# Altium schematic sheet MainBoard.SCHDOC
size B
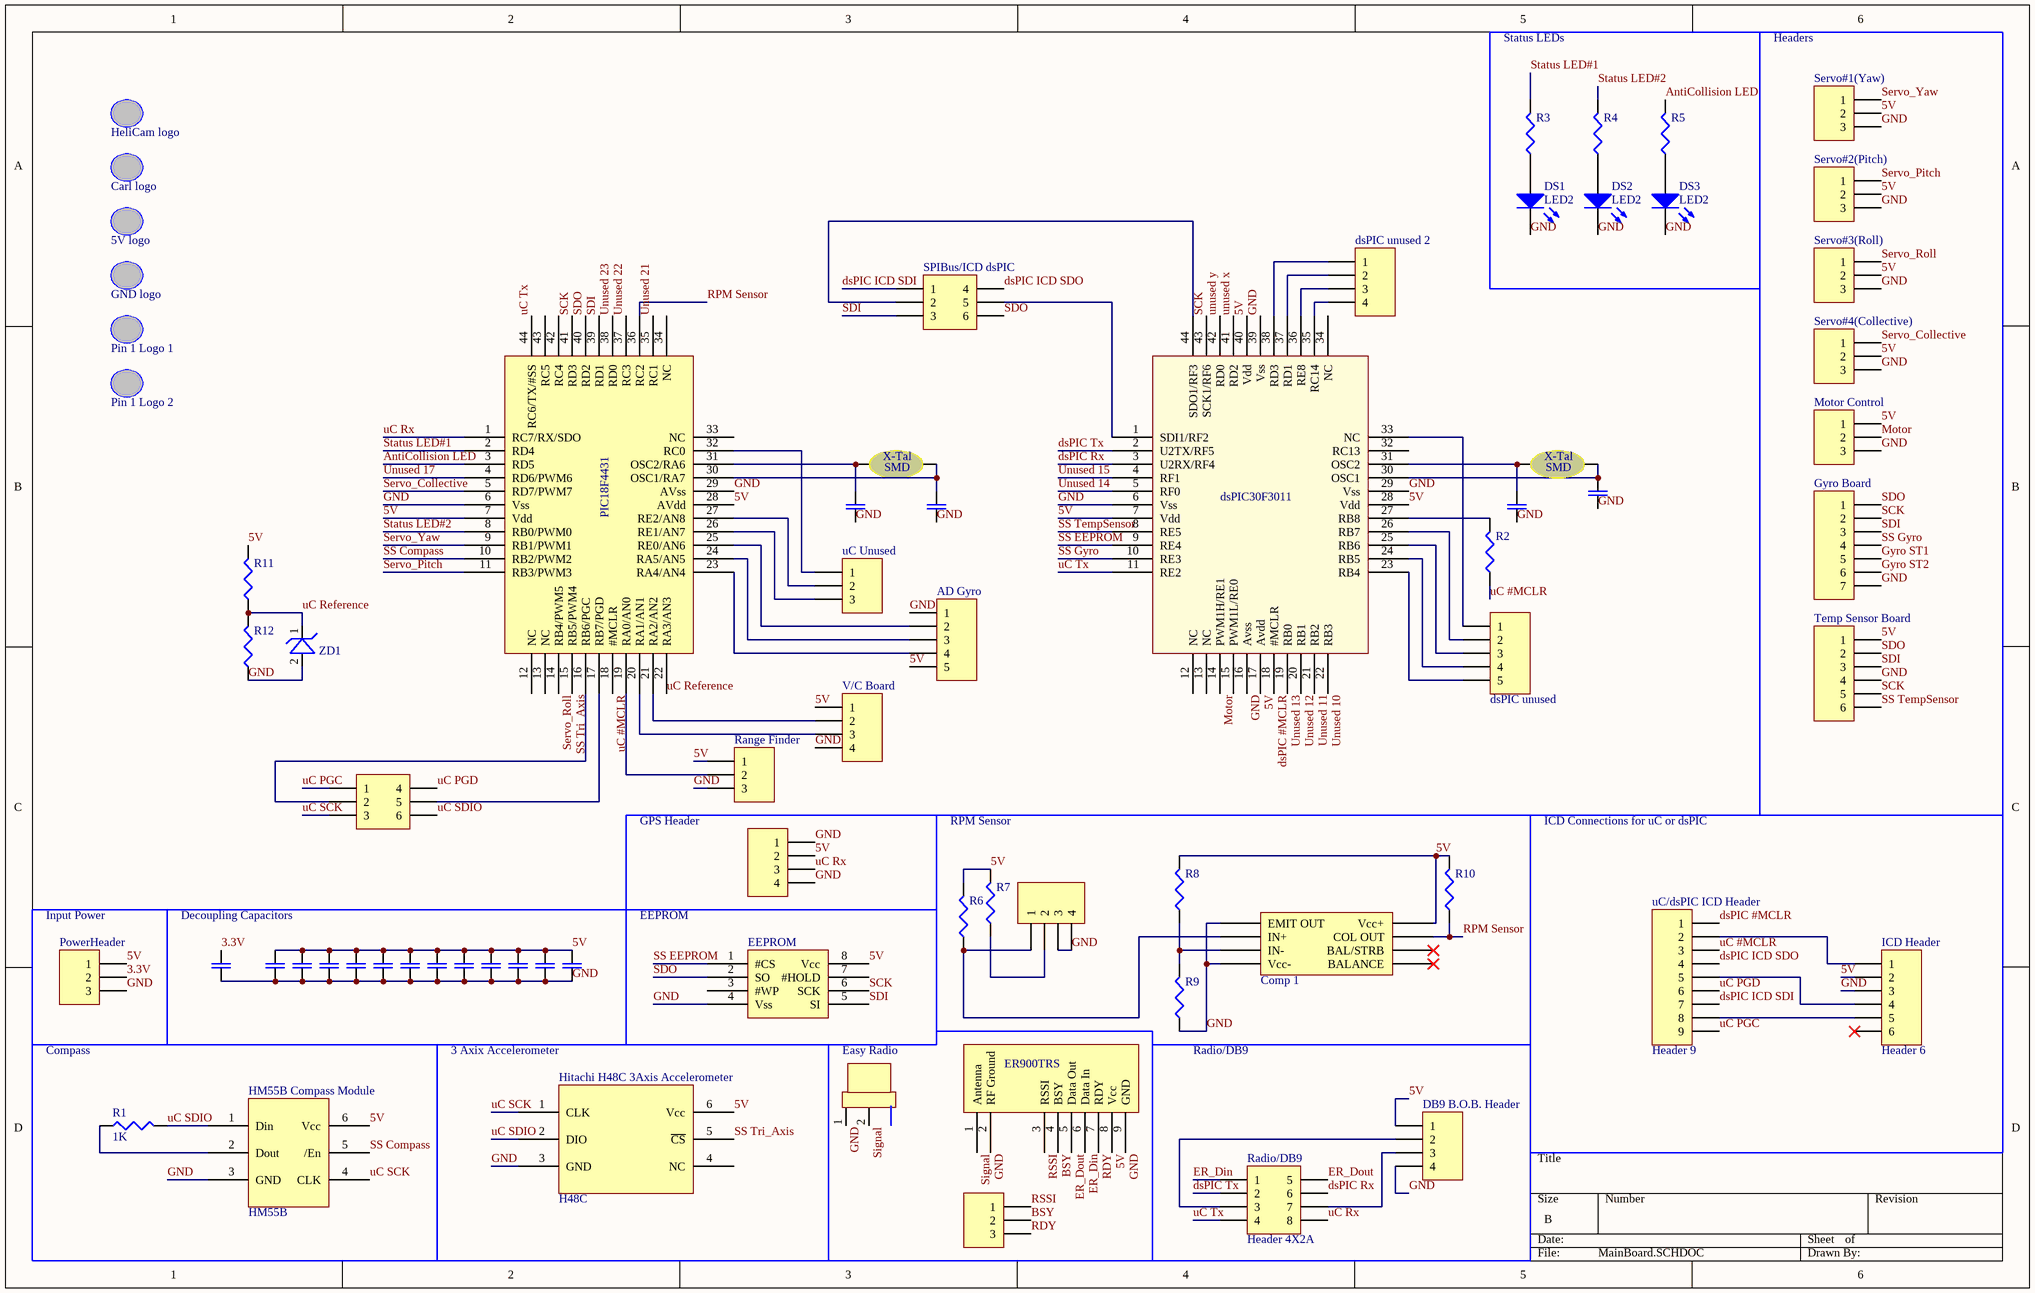
[diagram p0: MainBoard.SCHDOC]

## Parts
5V_logo  logo  [5V logo]  (value not drawn)
AD_Gyro  Header 5  [HDR1X5]  (value not drawn)
Antenna_Connector_1  Antenna Connector  [Antenna Connector]  (value not drawn)
Carl_logo  logo  [Carl Logo]  (value not drawn)
Comp_1  Comparator  [8-Pin DIP]  (value not drawn)
DB9_B.O.B._Header  DB9 Break Out Board Header  [HDR1X4]  (value not drawn)
DS1  LED2  [DSO-F2/D6.1]
DS2  LED2  [DSO-F2/D6.1]
DS3  LED2  [DSO-F2/D6.1]
dsPIC30F3011  dsPIC30F3011  [QFP7x7-G32/N]  (value not drawn)
dsPIC_unused  Header 5  [HDR1X5]  (value not drawn)
dsPIC_unused_2  Header 4  [HDR1X4]  (value not drawn)
EEPROM  25LC256 EEPROM  [EEPROM]  (value not drawn)
ER900TRS  Easy Radio 900MHz  [ER900TRS]  (value not drawn)
GND_logo  logo  [GND logo]  (value not drawn)
GPS_Header  GPS Header  [HDR1X4]  (value not drawn)
Gyro_Board  Header for Gyro Board  [HDR1X7]  (value not drawn)
H48C  Hitachi H48C 3Axis Accelerometer  [H48C]
HeliCam_logo  logo  [HeliCamosun]  (value not drawn)
HM55B  HM55B Compass Module  [HM55B]
ICD_Header  Header 6  [HDR1X6]
Motor_Control  Connector for Motor Control  [HDR1X3]  (value not drawn)
PIC18F4431  PIC18F4431  [QFP7x7-G32/N]  (value not drawn)
Pin_1_Logo_1  logo  [Pin 1 Logo]  (value not drawn)
Pin_1_Logo_2  logo  [Pin 1 Logo]  (value not drawn)
PowerHeader  Header 3  [HDR1X3]  (value not drawn)
R1  1K  [CR1608-0603]
R2  Res3  [CR1608-0603]  (value not drawn)
R3  Res3  [CR1608-0603]  (value not drawn)
R4  Res3  [CR1608-0603]  (value not drawn)
R5  Res3  [CR1608-0603]  (value not drawn)
R6  Res3  [CR1608-0603]  (value not drawn)
R7  Res3  [CR1608-0603]  (value not drawn)
R8  Res3  [CR1608-0603]  (value not drawn)
R9  Res3  [CR1608-0603]  (value not drawn)
R10  Res3  [CR1608-0603]  (value not drawn)
R11  Res3  [CR1608-0603]  (value not drawn)
R12  Res3  [CR1608-0603]  (value not drawn)
Radio/DB9  Header 4X2A  [HDR2X4_CEN]
Radio_Header  Extra Radio Pins  [HDR1X3]  (value not drawn)
Range_Finder  Header 3  [HDR1X3]  (value not drawn)
Servo#1(Yaw)  Connector for Servo Motor  [HDR1X3]  (value not drawn)
Servo#2(Pitch)  Connector for Servo Motor  [HDR1X3]  (value not drawn)
Servo#3(Roll)  Connector for Servo Motor  [HDR1X3]  (value not drawn)
Servo#4(Collective)  Connector for Servo Motor  [HDR1X3]  (value not drawn)
SMD_1206_1  SMD 1206  [SMD 1206]  (value not drawn)
SMD_1206_2  SMD 1206  [SMD 1206]  (value not drawn)
SMD_1206_3  SMD 1206  [SMD 1206]  (value not drawn)
SMD_1206_4  SMD 1206  [SMD 1206]  (value not drawn)
SMD_1206_5  SMD 1206  [SMD 1206]  (value not drawn)
SMD_1206_6  SMD 1206  [SMD 1206]  (value not drawn)
SMD_1206_7  SMD 1206  [SMD 1206]  (value not drawn)
SMD_1206_8  SMD 1206  [SMD 1206]  (value not drawn)
SMD_1206_9  SMD 1206  [SMD 1206]  (value not drawn)
SMD_1206_10  SMD 1206  [SMD 1206]  (value not drawn)
SMD_1206_11  SMD 1206  [SMD 1206]  (value not drawn)
SMD_1206_12  SMD 1206  [SMD 1206]  (value not drawn)
SMD_1206_13  SMD 1206  [SMD 1206]  (value not drawn)
SMD_1206_14  SMD 1206  [SMD 1206]  (value not drawn)
SMD_1206_15  SMD 1206  [SMD 1206]  (value not drawn)
SMD_1206_16  SMD 1206  [SMD 1206]  (value not drawn)
SMD_1206_17  SMD 1206  [SMD 1206]  (value not drawn)
SMD_X-Tal_1  SMD X-Tal  [SMD X-Tal]  (value not drawn)
SMD_X-Tal_2  SMD X-Tal  [SMD X-Tal]  (value not drawn)
SPIBus/ICD  Header 3X2A  [HDR2X3_CEN]  (value not drawn)
SPIBus/ICD_dsPIC  Header 3X2A  [HDR2X3_CEN]  (value not drawn)
Stef's_Connector  Header 4  [HDR1X4]  (value not drawn)
Temp_Sensor_Board  SPI Temp Sensor Header  [HDR1X6]  (value not drawn)
uC/dsPIC_ICD_Header  Header 9  [HDR1X9]
uC_Unused  Header 3  [HDR1X3]  (value not drawn)
V/C_Board  Voltage/Current Board Header  [HDR1X4]  (value not drawn)
ZD1  CZRF52C3  [Zener Diode]  (value not drawn)

## Nets
3.3V: PowerHeader.2 SMD_1206_10.1
5V: AD_Gyro.5 Comp_1.8(Vcc+) DB9_B.O.B._Header.1 dsPIC30F3011.7(Vdd) dsPIC30F3011.17(Avdd) dsPIC30F3011.28(Vdd) dsPIC30F3011.40(Vdd) EEPROM.8(Vcc) ER900TRS.8(Vcc) GPS_Header.2 H48C.6(Vcc) HM55B.6(Vcc) ICD_Header.2 Motor_Control.1 PIC18F4431.7(Vdd) PIC18F4431.28(AVdd) PowerHeader.1 R6.2 R7.2 R8.2 R10.2 R11.2 Range_Finder.1 Servo#1(Yaw).2 Servo#2(Pitch).2 Servo#3(Roll).2 Servo#4(Collective).2 SMD_1206_1.1 SMD_1206_2.1 SMD_1206_3.1 SMD_1206_4.1 SMD_1206_5.1 SMD_1206_6.1 SMD_1206_7.1 SMD_1206_8.1 SMD_1206_9.1 SMD_1206_15.1 SMD_1206_16.1 SMD_1206_17.1 Temp_Sensor_Board.1 V/C_Board.1
AntiCollision LED: PIC18F4431.3(RD5) R5.2
BSY: ER900TRS.4(BSY) Radio_Header.2
dsPIC #MCLR: dsPIC30F3011.18(#MCLR) uC/dsPIC_ICD_Header.1
dsPIC ICD SDI: SPIBus/ICD_dsPIC.1 uC/dsPIC_ICD_Header.7
dsPIC ICD SDO: SPIBus/ICD_dsPIC.4 uC/dsPIC_ICD_Header.4
dsPIC Rx: dsPIC30F3011.3(U2RX/RF4) Radio/DB9.6
dsPIC Tx: dsPIC30F3011.2(U2TX/RF5) Radio/DB9.2
ER_Din: ER900TRS.6(Data_In) Radio/DB9.1
ER_Dout: ER900TRS.5(Data_Out) Radio/DB9.5
GND: AD_Gyro.1 Antenna_Connector_1.1 Comp_1.1(EMIT_OUT) Comp_1.4(Vcc-) DB9_B.O.B._Header.4 DS1.2(K) DS2.2(K) DS3.2(K) dsPIC30F3011.6(Vss) dsPIC30F3011.16(Avss) dsPIC30F3011.29(Vss) dsPIC30F3011.39(Vss) EEPROM.4(Vss) ER900TRS.2(RF_Ground) ER900TRS.9(GND) GPS_Header.1 GPS_Header.4 Gyro_Board.7 H48C.3(GND) HM55B.3(GND) ICD_Header.3 Motor_Control.3 PIC18F4431.6(Vss) PIC18F4431.29(AVss) PowerHeader.3 R9.1 R12.1 Range_Finder.3 Servo#1(Yaw).3 Servo#2(Pitch).3 Servo#3(Roll).3 Servo#4(Collective).3 SMD_1206_1.2 SMD_1206_2.2 SMD_1206_3.2 SMD_1206_4.2 SMD_1206_5.2 SMD_1206_6.2 SMD_1206_7.2 SMD_1206_8.2 SMD_1206_9.2 SMD_1206_10.2 SMD_1206_11.2 SMD_1206_12.2 SMD_1206_13.2 SMD_1206_14.2 SMD_1206_15.2 SMD_1206_16.2 SMD_1206_17.2 Stef's_Connector.3 Stef's_Connector.4 Temp_Sensor_Board.4 V/C_Board.4 ZD1.2
Gyro ST1: Gyro_Board.5
Gyro ST2: Gyro_Board.6
Motor: dsPIC30F3011.14(PWM1H/RE1) Motor_Control.2
RDY: ER900TRS.7(RDY) Radio_Header.3
RPM Sensor: Comp_1.7(COL_OUT) PIC18F4431.36(RC2) R10.1
RSSI: ER900TRS.3(RSSI) Radio_Header.1
SCK: dsPIC30F3011.43(SCK1/RF6) EEPROM.6(SCK) Gyro_Board.2 PIC18F4431.41(RD3) Temp_Sensor_Board.5
SDI: EEPROM.5(SI) Gyro_Board.3 PIC18F4431.39(RD1) SPIBus/ICD_dsPIC.3 Temp_Sensor_Board.3
SDO: EEPROM.2(SO) Gyro_Board.1 PIC18F4431.40(RD2) SPIBus/ICD_dsPIC.6 Temp_Sensor_Board.2
Servo_Collective: PIC18F4431.5(RD7/PWM7) Servo#4(Collective).1
Servo_Pitch: PIC18F4431.11(RB3/PWM3) Servo#2(Pitch).1
Servo_Roll: PIC18F4431.14(RB4/PWM5) Servo#3(Roll).1
Servo_Yaw: PIC18F4431.9(RB1/PWM1) Servo#1(Yaw).1
Signal: Antenna_Connector_1.2 ER900TRS.1(Antenna)
SS Compass: HM55B.5(/En) PIC18F4431.10(RB2/PWM2)
SS EEPROM: dsPIC30F3011.9(RE4) EEPROM.1(#CS)
SS Gyro: dsPIC30F3011.10(RE3) Gyro_Board.4
SS TempSensor: dsPIC30F3011.8(RE5) Temp_Sensor_Board.6
SS Tri_Axis: H48C.5(~{CS}) PIC18F4431.15(RB5/PWM4)
Status LED#1: PIC18F4431.2(RD4) R3.2
Status LED#2: PIC18F4431.8(RB0/PWM0) R4.2
uC #MCLR: PIC18F4431.18(#MCLR) R2.1 uC/dsPIC_ICD_Header.3
uC PGC: SPIBus/ICD.1 uC/dsPIC_ICD_Header.9
uC PGD: SPIBus/ICD.4 uC/dsPIC_ICD_Header.6
uC Reference: PIC18F4431.22(RA3/AN3) R11.1 R12.2 ZD1.1
uC Rx: GPS_Header.3 PIC18F4431.1(RC7/RX/SDO) Radio/DB9.8
uC SCK: H48C.1(CLK) HM55B.4(CLK) SPIBus/ICD.3
uC SDIO: H48C.2(DIO) HM55B.1(Din) R1.2 SPIBus/ICD.6
uC Tx: dsPIC30F3011.11(RE2) PIC18F4431.44(RC6/TX/#SS) Radio/DB9.4
Unused 10: dsPIC30F3011.22(RB3)
Unused 11: dsPIC30F3011.21(RB2)
Unused 12: dsPIC30F3011.20(RB1)
Unused 13: dsPIC30F3011.19(RB0)
Unused 14: dsPIC30F3011.5(RF0)
Unused 15: dsPIC30F3011.4(RF1)
Unused 17: PIC18F4431.4(RD6/PWM6)
Unused 21: PIC18F4431.35(RC1)
Unused 22: PIC18F4431.37(RC3)
Unused 23: PIC18F4431.38(RD0)
unused x: dsPIC30F3011.41(RD2)
unused y: dsPIC30F3011.42(RD0)
NetAD_Gyro_2: AD_Gyro.2 PIC18F4431.25(RE0/AN6)
NetAD_Gyro_3: AD_Gyro.3 PIC18F4431.24(RA5/AN5)
NetAD_Gyro_4: AD_Gyro.4 PIC18F4431.23(RA4/AN4)
NetComp_1_2: Comp_1.2(IN+) R6.1 Stef's_Connector.1
NetComp_1_3: Comp_1.3(IN-) R8.1 R9.2
NetDB9_B.O.B._Header_2: DB9_B.O.B._Header.2 Radio/DB9.3
NetDB9_B.O.B._Header_3: DB9_B.O.B._Header.3 Radio/DB9.7
NetDS1_1: DS1.1(A) R3.1
NetDS2_1: DS2.1(A) R4.1
NetDS3_1: DS3.1(A) R5.1
NetdsPIC30F3011_1: dsPIC30F3011.1(SDI1/RF2) SPIBus/ICD_dsPIC.5
NetdsPIC30F3011_23: dsPIC30F3011.23(RB4) dsPIC_unused.5
NetdsPIC30F3011_24: dsPIC30F3011.24(RB5) dsPIC_unused.4
NetdsPIC30F3011_25: dsPIC30F3011.25(RB6) dsPIC_unused.3
NetdsPIC30F3011_26: dsPIC30F3011.26(RB7) dsPIC_unused.2
NetdsPIC30F3011_27: dsPIC30F3011.27(RB8) R2.2
NetdsPIC30F3011_30: dsPIC30F3011.30(OSC1) SMD_1206_14.1 SMD_X-Tal_2.2
NetdsPIC30F3011_31: dsPIC30F3011.31(OSC2) SMD_1206_13.1 SMD_X-Tal_2.1
NetdsPIC30F3011_33: dsPIC30F3011.33(NC) dsPIC_unused.1
NetdsPIC30F3011_35: dsPIC30F3011.35(RC14) dsPIC_unused_2.4
NetdsPIC30F3011_36: dsPIC30F3011.36(RE8) dsPIC_unused_2.3
NetdsPIC30F3011_37: dsPIC30F3011.37(RD1) dsPIC_unused_2.2
NetdsPIC30F3011_38: dsPIC30F3011.38(RD3) dsPIC_unused_2.1
NetdsPIC30F3011_44: dsPIC30F3011.44(SDO1/RF3) SPIBus/ICD_dsPIC.2
NetHM55B_2: HM55B.2(Dout) R1.1
NetICD_Header_1: ICD_Header.1 uC/dsPIC_ICD_Header.2
NetICD_Header_4: ICD_Header.4 uC/dsPIC_ICD_Header.5
NetICD_Header_5: ICD_Header.5 uC/dsPIC_ICD_Header.8
NetPIC18F4431_16: PIC18F4431.16(RB6/PGC) SPIBus/ICD.2
NetPIC18F4431_17: PIC18F4431.17(RB7/PGD) SPIBus/ICD.5
NetPIC18F4431_19: PIC18F4431.19(RA0/AN0) Range_Finder.2
NetPIC18F4431_20: PIC18F4431.20(RA1/AN1) V/C_Board.3
NetPIC18F4431_21: PIC18F4431.21(RA2/AN2) V/C_Board.2
NetPIC18F4431_26: PIC18F4431.26(RE1/AN7) uC_Unused.3
NetPIC18F4431_27: PIC18F4431.27(RE2/AN8) uC_Unused.2
NetPIC18F4431_30: PIC18F4431.30(OSC1/RA7) SMD_1206_12.1 SMD_X-Tal_1.2
NetPIC18F4431_31: PIC18F4431.31(OSC2/RA6) SMD_1206_11.1 SMD_X-Tal_1.1
NetPIC18F4431_32: PIC18F4431.32(RC0) uC_Unused.1
NetR7_1: R7.1 Stef's_Connector.2

Not connected (* = marked no-connect by the designer): Comp_1 5(BALANCE)* 6(BAL/STRB)*; dsPIC30F3011 12(NC) 13(NC) 15(PWM1L/RE0) 32(RC13) 34(NC); EEPROM 3(#WP) 7(#HOLD); H48C 4(NC); ICD_Header 6*; PIC18F4431 12(NC) 13(NC) 33(NC) 34(NC) 42(RC4) 43(RC5)

## Notes on the sheet
- Status LEDs
- Headers
- (near Range_Finder) GPS Header
- RPM Sensor
- ICD Connections for uC or dsPIC
- (near PowerHeader) Input Power
- Decoupling Capacitors
- EEPROM
- Compass
- 3 Axix Accelerometer
- Easy Radio
- (near R9) Radio/DB9
- (in symbol SMD X-Tal) X-Tal; SMD

## Library data of the parts
AD_Gyro dsPIC_unused = Header 5: Header, 5-Pin; LatestRevisionDate: 17-Jul-2002; LatestRevisionNote: Re-released for DXP Platform.; Publisher: Altium Limited
Comp_1 = LP311P
DB9_B.O.B._Header dsPIC_unused_2 GPS_Header Stef's_Connector V/C_Board = Header 4: Header, 4-Pin; Publisher: Altium Limited
  DB9_B.O.B._Header V/C_Board: Revision: 17-Jul-2002: Re-released for DXP Platform.
  dsPIC_unused_2 GPS_Header Stef's_Connector: LatestRevisionDate: 17-Jul-2002; LatestRevisionNote: Re-released for DXP Platform.
DS1-DS3 = LED2: Typical RED, GREEN, YELLOW, AMBER GaAs LED; Published: 8-Jun-2000; LatestRevisionDate: 17-Jul-2002; LatestRevisionNote: Re-released for DXP Platform.; PackageDocument: Feb-2002; PackageReference: 3.2X1.6X1.1; Publisher: Altium Limited
EEPROM = EEPROM
ER900TRS = ER900TRS
Gyro_Board = Header 7: Header, 7-Pin; Revision: 17-Jul-2002: Re-released for DXP Platform.; Publisher: Altium Limited
H48C = H48C: 3 Axis Accelerometer
ICD_Header Temp_Sensor_Board = Header 6: Header, 6-Pin; Publisher: Altium Limited
  ICD_Header: LatestRevisionDate: 17-Jul-2002; LatestRevisionNote: Re-released for DXP Platform.
  Temp_Sensor_Board: Revision: 17-Jul-2002: Re-released for DXP Platform.
Motor_Control PowerHeader Radio_Header Range_Finder Servo#1(Yaw) Servo#2(Pitch) Servo#3(Roll) Servo#4(Collective) uC_Unused = Header 3: Header, 3-Pin; Publisher: Altium Limited
  Motor_Control PowerHeader Servo#1(Yaw) Servo#2(Pitch) Servo#3(Roll) Servo#4(Collective): Revision: 17-Jul-2002: Re-released for DXP Platform.
  Radio_Header Range_Finder uC_Unused: LatestRevisionDate: 17-Jul-2002; LatestRevisionNote: Re-released for DXP Platform.
R1-R12 = Res3: Resistor; Published: 8-Jun-2000; LatestRevisionDate: 4-Mar-2005; LatestRevisionNote: PCB Footprint replaced.; Publisher: Altium Limited
Radio/DB9 = Header 4X2A: Header, 4-Pin, Dual row; LatestRevisionDate: 17-Jul-2002; LatestRevisionNote: Re-released for DXP Platform.; Publisher: Altium Limited
SMD_1206_1-SMD_1206_17 = SMD 1206: SMD 1206 Package Type
SPIBus/ICD SPIBus/ICD_dsPIC = Header 3X2A: Header, 3-Pin, Dual row; LatestRevisionDate: 17-Jul-2002; LatestRevisionNote: Re-released for DXP Platform.; Publisher: Altium Limited
uC/dsPIC_ICD_Header = Header 9: uC/dsPIC ICD Header; LatestRevisionDate: 17-Jul-2002; LatestRevisionNote: Re-released for DXP Platform.; Publisher: Altium Limited